# EAGLE design Fio-v30 (EAGLE 5.11)
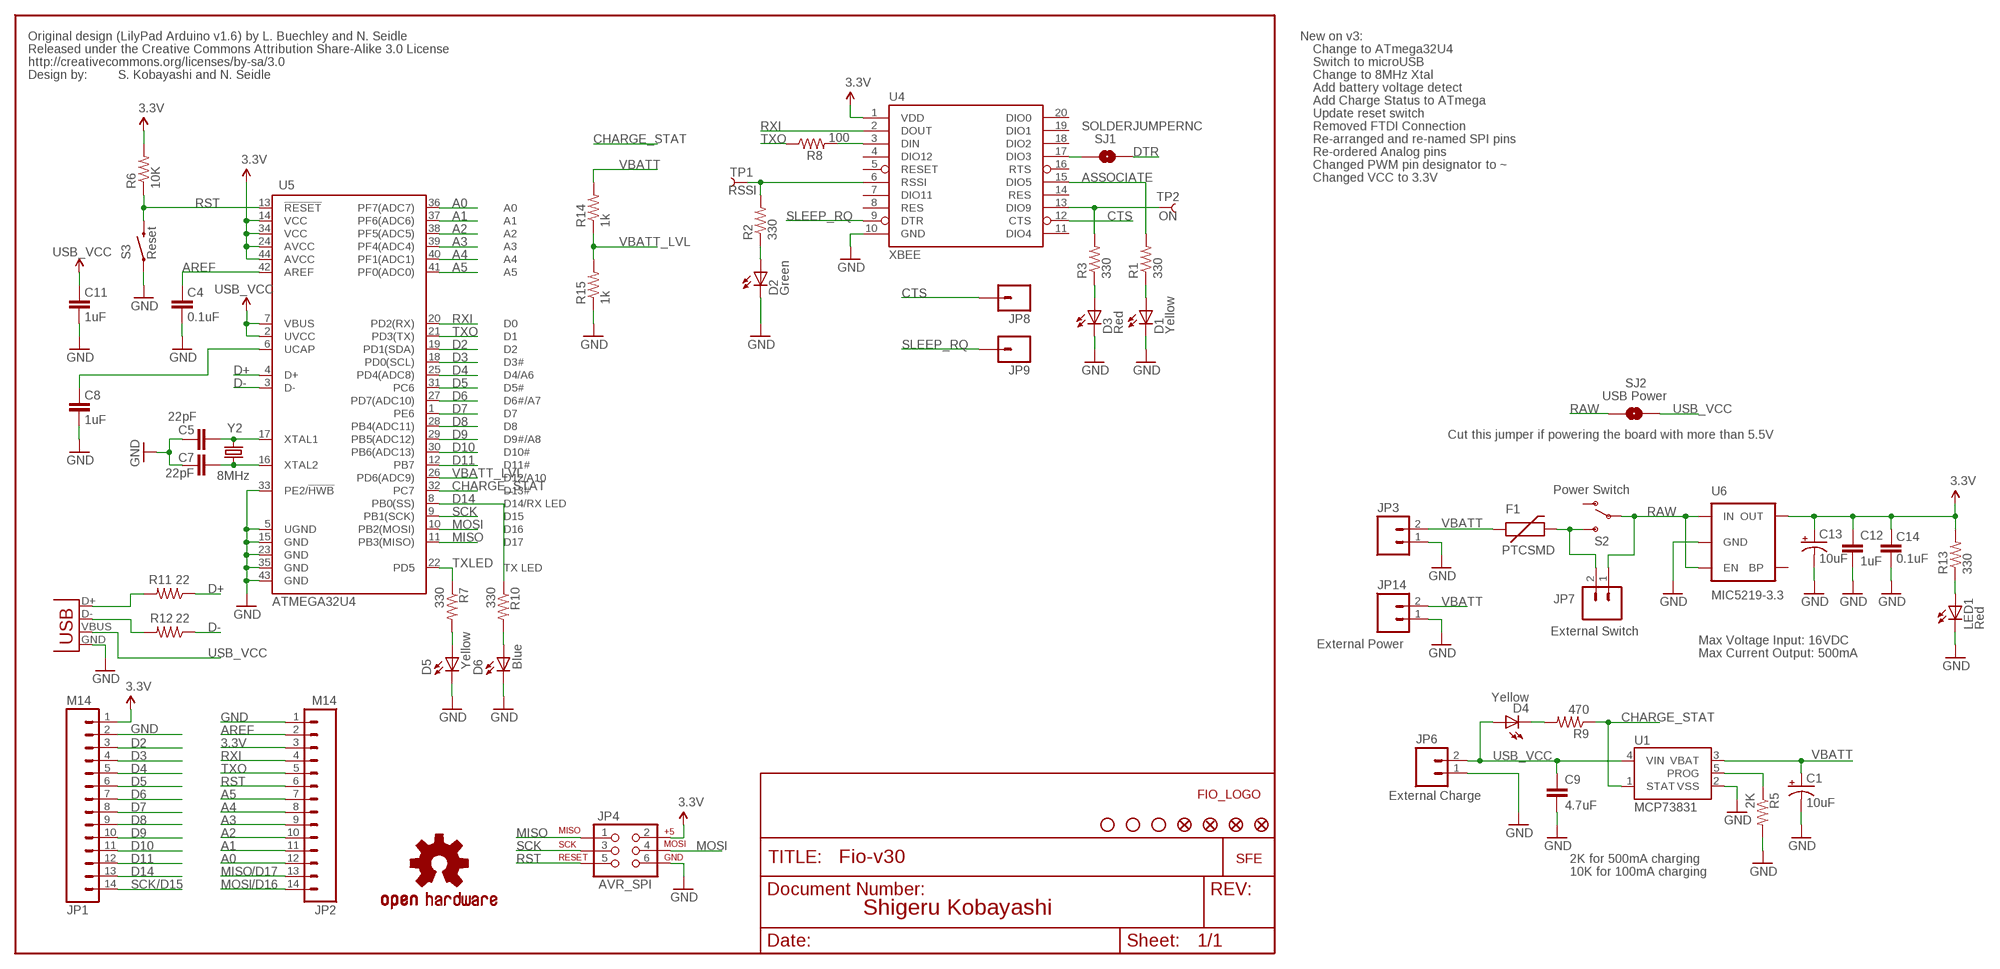
[diagram p0: schematic, sheet 1]

## Parts
C1  10uF  CAP_POL1206  [EIA3216]
C4  0.1uF  CAP0402-CAP  [0402-CAP]
C5  22pF  CAP0402-CAP  [0402-CAP]
C7  22pF  CAP0402-CAP  [0402-CAP]
C8  1uF  CAP0402-CAP  [0402-CAP]
C9  4.7uF  CAP0402-CAP  [0402-CAP]
C11  1uF  CAP0402-CAP  [0402-CAP]
C12  1uF  CAP0402-CAP  [0402-CAP]
C13  10uF  CAP_POL1206  [EIA3216]
C14  0.1uF  CAP0402-CAP  [0402-CAP]
D1  Yellow  LED0603  [LED-0603]
D2  Green  LED0603  [LED-0603]
D3  Red  LED0603  [LED-0603]
D4  Yellow  LED0603  [LED-0603]
D5  Yellow  LED0603  [LED-0603]
D6  Blue  LED0603  [LED-0603]
F1  PTCSMD  [PTC-1206]
JP1  M14  [1X14]
JP2  M14  [1X14]
JP3  M02-JST-2MM-SMT  [JST-2-SMD]
JP4  AVR_SPI  AVR_SPI_PRG_6PTH  [2X3]
JP5  STAND-OFF  [STAND-OFF]
JP6  External Charge  M02PTH  [1X02]
JP7  External Switch  M02PTH  [1X02]
JP8  M01PTH  [1X01]
JP9  M01PTH  [1X01]
JP10  FIDUCIALUFIDUCIAL  FIDUCIAL1X2  [FIDUCIAL-1X2]
JP11  FIDUCIALUFIDUCIAL  FIDUCIAL1X2  [FIDUCIAL-1X2]
JP12  FIDUCIALUFIDUCIAL  FIDUCIAL1X2  [FIDUCIAL-1X2]
JP13  FIDUCIALUFIDUCIAL  FIDUCIAL1X2  [FIDUCIAL-1X2]
JP14  External Power  M02PTH  [1X02]
JP16  STAND-OFF  [STAND-OFF]
JP17  STAND-OFF  [STAND-OFF]
LED1  Red  LED0603  [LED-0603]
R1  330  RESISTOR0402-RES  [0402-RES]
R2  330  RESISTOR0402-RES  [0402-RES]
R3  330  RESISTOR0402-RES  [0402-RES]
R5  2K  RESISTOR0402-RES  [0402-RES]
R6  10K  RESISTOR0402-RES  [0402-RES]
R7  330  RESISTOR0402-RES  [0402-RES]
R8  100  RESISTOR0402-RES  [0402-RES]
R9  470  RESISTOR0402-RES  [0402-RES]
R10  330  RESISTOR0402-RES  [0402-RES]
R11  22  RESISTOR0402-RES  [0402-RES]
R12  22  RESISTOR0402-RES  [0402-RES]
R13  330  RESISTOR0402-RES  [0402-RES]
R14  1k  RESISTOR0402-RES  [0402-RES]
R15  1k  RESISTOR0402-RES  [0402-RES]
S2  Power Switch  SWITCH-SPSTSMD  [AYZ0202]
S3  Reset  SWITCH-MOMENTARY-2SMD  [TACTILE_SWITCH_SMD]
SJ1  SOLDERJUMPERNC  [SJ_2S]
SJ2  USB Power  SOLDERJUMPERTRACE  [SJ_2S-TRACE]
TP1  RSSI  TEST-POINT3X5  [PAD.03X.05]
TP2  ON  TEST-POINT3X5  [PAD.03X.05]
U1  MCP73831  [SOT23-5]
U4  XBEE  XBEE-1B3  [XBEE-SMD]
U5  ATMEGA32U4  ATMEGA32U4QFN2  [QFN-44-NOPAD]
U6  MIC5219-3.3  V_REG_LDOSMD  [SOT23-5]
U$1  LOGO-SFENEW  [SFE-NEW-WEBLOGO]
U$2  OSHW-LOGOS  [OSHW-LOGO-S]
U$3  CREATIVE_COMMONS  [CREATIVE_COMMONS]
U$6  FIO_LOGOV2  [FUNNEL_LOGO_BOTTOM_V2]
X2  USB-MICROB  [USB-MICROB]
Y2  8MHz  CRYSTAL5X3  [CRYSTAL-SMD-5X3]

## Nets
3.3V [vcc]: C12.1 C13.A(+) C14.2 JP1.1 JP2.3 JP4.2 R6.2 R13.2 U4.1(VDD) U5.14(VCC) U5.24(AVCC) U5.34(VCC) U5.44(AVCC) U6.5(OUT)
A0: JP2.12 U5.36(PF7(ADC7))
A1: JP2.11 U5.37(PF6(ADC6))
A2: JP2.10 U5.38(PF5(ADC5))
A3: JP2.9 U5.39(PF4(ADC4))
A4: JP2.8 U5.40(PF1(ADC1))
A5: JP2.7 U5.41(PF0(ADC0))
AREF: C4.2 JP2.2 U5.42(AREF)
ASSOCIATE: R1.2 U4.15(DIO5)
CHARGE_STAT: R9.1 U1.1(STAT) U5.32(PC7)
CTS: JP8.1 U4.12(CTS)
D2: JP1.3 U5.19(PD1(SDA))
D3: JP1.4 U5.18(PD0(SCL))
D4: JP1.5 U5.25(PD4(ADC8))
D5: JP1.6 U5.31(PC6)
D6: JP1.7 U5.27(PD7(ADC10))
D7: JP1.8 U5.1(PE6)
D8: JP1.9 U5.28(PB4(ADC11))
D9: JP1.10 U5.29(PB5(ADC12))
D10: JP1.11 U5.30(PB6(ADC13))
D11: JP1.12 U5.12(PB7)
D14: JP1.13 R10.1 U5.8(PB0(SS))
D+: R11.1 U5.4(D+)
D-: R12.1 U5.3(D-)
DTR: SJ1.2
GND: C1.C(-) C4.1 C5.2 C7.2 C8.1 C9.2 C11.1 C12.2 C13.C(-) C14.1 D1.C D2.C D3.C D5.C D6.C JP1.2 JP2.1 JP3.1 JP4.6 JP6.1 JP14.1 LED1.C R5.2 R15.1 S3.1 U1.2(VSS) U4.10(GND) U5.5(UGND) U5.15(GND) U5.23(GND) U5.33(PE2/!HWB) U5.35(GND) U5.43(GND) U6.2(GND) X2.GND
MISO: JP2.13 JP4.1 U5.11(PB3(MISO))
MOSI: JP2.14 JP4.4 U5.10(PB2(MOSI))
N$1: R3.2 TP2.P$1 U4.13(DIO9)
N$2: D1.A R1.1
N$3: D2.A R2.1
N$4: R2.2 TP1.P$1 U4.6(RSSI)
N$6: D3.A R3.1
N$7: R8.2 U4.3(DIN)
N$8: D4.C R9.2
N$9: F1.2 JP7.2 S2.3(S)
N$11: R5.1 U1.5(PROG)
N$13: SJ1.1 U4.17(DIO3)
N$15: D5.A R7.2
N$16: C7.1 U5.16(XTAL2) Y2.1
N$17: C5.1 U5.17(XTAL1) Y2.3
N$19: D6.A R10.2
N$20: R12.2 X2.D-
N$21: R11.2 X2.D+
N$38: LED1.A R13.1
RAW [vcc]: JP7.1 S2.2(P) SJ2.1 U6.1(IN) U6.3(EN)
RST: JP2.6 JP4.5 R6.1 S3.3 U5.13(!RESET)
RXI: JP2.4 U4.2(DOUT) U5.20(PD2(RX))
SCK: JP1.14 JP4.3 U5.9(PB1(SCK))
SLEEP_RQ: JP9.1 U4.9(DTR)
TXLED: R7.1 U5.22(PD5)
TXO: JP2.5 R8.1 U5.21(PD3(TX))
UCAP: C8.2 U5.6(UCAP)
USB_VCC: C9.1 C11.2 D4.A JP6.2 SJ2.2 U1.4(VIN) U5.2(UVCC) U5.7(VBUS) X2.VBUS
VBATT: C1.A(+) F1.1 JP3.2 JP14.2 R14.2 U1.3(VBAT)
VBATT_LVL: R14.1 R15.2 U5.26(PD6(ADC9))
Unconnected: S2.1(O) U4.4(DIO12) U4.5(RESET) U4.7(DIO11) U4.8(RES) U4.11(DIO4) U4.14(RES) U4.16(RTS) U4.18(DIO2) U4.19(DIO1) U4.20(DIO0) U6.4(BP)

## Notes on the sheet
- Original design (LilyPad Arduino v1.6) by L. Buechley and N. Seidle | New on v3:
- Change to ATmega32U4
- Switch to microUSB
- S. Kobayashi and N. Seidle | Change to 8MHz Xtal
- Add battery voltage detect
- Add Charge Status to ATmega
- Update reset switch
- Removed FTDI Connection
- Re-arranged and re-named SPI pins
- Re-ordered Analog pins
- Changed PWM pin designator to ~
- Changed VCC to 3.3V
- Cut this jumper if powering the board with more than 5.5V
- Max Voltage Input: 16VDC
- Max Current Output: 500mA
- 2K for 500mA charging
- /D17 | 10K for 100mA charging
- /D15 | /D16
- Shigeru Kobayashi

## Library data of the parts
C1 C13 = SparkFun:CAP_POL: Capacitor Polarized These are standard SMD and PTH capacitors. Normally 10uF, 47uF, and 100uF in electrolytic and tantalum varieties. Always verify the external diameter of the through hole cap, it varies with capacity, voltage, and manufacturer. The EIA devices should be standard.
C4 C5 C7-C9 C11 C12 C14 = SparkFun:CAP: Capacitor Standard 0603 ceramic capacitor, and 0.1" leaded capacitor.
D1-D6 LED1 = SparkFun:LED: LEDs Standard schematic elements and footprints for 5mm, 3mm, 1206, and 0603 sized LEDs. 5mm - Spark Fun Electronics SKU : COM-00529 (and others)
F1 = SparkFun:PTC: Resettable Fuse PTC Resettable Fuse. Spark Fun Electronics SKU : COM-08357
JP1 JP2 = SparkFun:M14: Header 14 Standard 14-pin 0.1" header. Use with straight break away headers (SKU : PRT-00116), right angle break away headers (PRT-00553), swiss pins (PRT-00743), machine pins (PRT-00117), and female headers (PRT-00115).
JP3 JP6 JP7 JP14 = SparkFun:M02: Header 2 Standard 2-pin 0.1" header. Use with straight break away headers (SKU : PRT-00116), right angle break away headers (PRT-00553), swiss pins (PRT-00743), machine pins (PRT-00117), and female headers (PRT-00115). Molex polarized connector foot print use with SKU : PRT-08233 with associated crimp pins and housings.
JP4 = SparkFun:AVR_SPI_PRG_6: AVR ISP 6 Pin This is the reduced ISP connector for AVR programming. Common on Arduino. This footprint will take up less PCB space and can be used with a 10-pin to 6-pin adapter such as SKU: BOB-08508
JP5 JP16 JP17 = SparkFun:STAND-OFF: Stand Off This is the mechanical footprint for a #4 phillips button head screw. Use the keepout ring to avoid running the screw head into surrounding components. SKU : PRT-00447
JP8 JP9 = SparkFun:M01: Header 1 Standard 1-pin 0.1" header. Use with straight break away headers (SKU : PRT-00116), right angle break away headers (PRT-00553), swiss pins (PRT-00743), machine pins (PRT-00117), and female headers (PRT-00115).
JP10-JP13 = SparkFun:FIDUCIAL: Fiducial Alignment Points Various fiducial points for machine vision alignment.
R1-R3 R5-R15 = SparkFun:RESISTOR: Resistor Basic schematic elements and footprints for 0603, 1206, and PTH resistors.
S2 = SparkFun:SWITCH-SPST: SPST Switch Simple slide switch. Spark Fun Electronics SKU : COM-00102
S3 = SparkFun:SWITCH-MOMENTARY-2
SJ1 SJ2 = SparkFun:SOLDERJUMPER: Solder Jumper Standard SMD solder jumper. Used to automate production. Two varients : Normally Open and Normally Closed are the same, but have different paste layers. NC will have a large amount of paste and should jumper during reflow.
TP1 TP2 = SparkFun:TEST-POINT
U1 = SparkFun:MCP73831: Microchip's MCP73831 Miniature single cell, fully integrated Li-Ion, Li-polymer charge management controller http://ww1.microchip.com/downloads/en/DeviceDoc/21984a.pdf
U4 = SparkFun:XBEE-1
U5 = QFN44:ATMEGA32U4
U6 = SparkFun:V_REG_LDO: Voltage Regulator LDO Standard 150mA LDO voltage regulator in SOT-23 layout. Micrel part MIC5205. BP (by-pass) pin is used to lower output noise with 470pF cap.
U$1 = SparkFun:LOGO-SFE: Spark Fun Electronics PCB Logo This is the standard Spark Fun Electronics PCB logo.
U$2 = SparkFun:OSHW-LOGO: Open Source Hardware Logo This logo indicates the piece of hardware it is found on incorporates a OSHW license and/or adheres to the definition of open source hardware found here: http://freedomdefined.org/OSHW
U$3 = SparkFun:CREATIVE_COMMONS
U$6 = SparkFun:FIO_LOGO
X2 = SparkFun:USB: USB Connectors USB-B-PTH is fully proven SKU : PRT-00139 USB-miniB is fully proven SKU : PRT-00587 USB-A-PCB is untested. USB-A-H is throughly reviewed, but untested. Spark Fun Electronics SKU : PRT-00437 USB-B-SMT is throughly reviewed, but untested. Needs silkscreen touching up. USB-A-S has not been used/tested USB-MB-H has not been used/tested
Y2 = SparkFun:CRYSTAL: Crystals Various standard crystals. Proven footprints. Spark Fun Electronics SKU : COM-00534

## Net classes
0 Default: width 0.203 mm
2 LEDPower: width 0.203 mm
3 ButtonSignal: width 0.203 mm

## Board
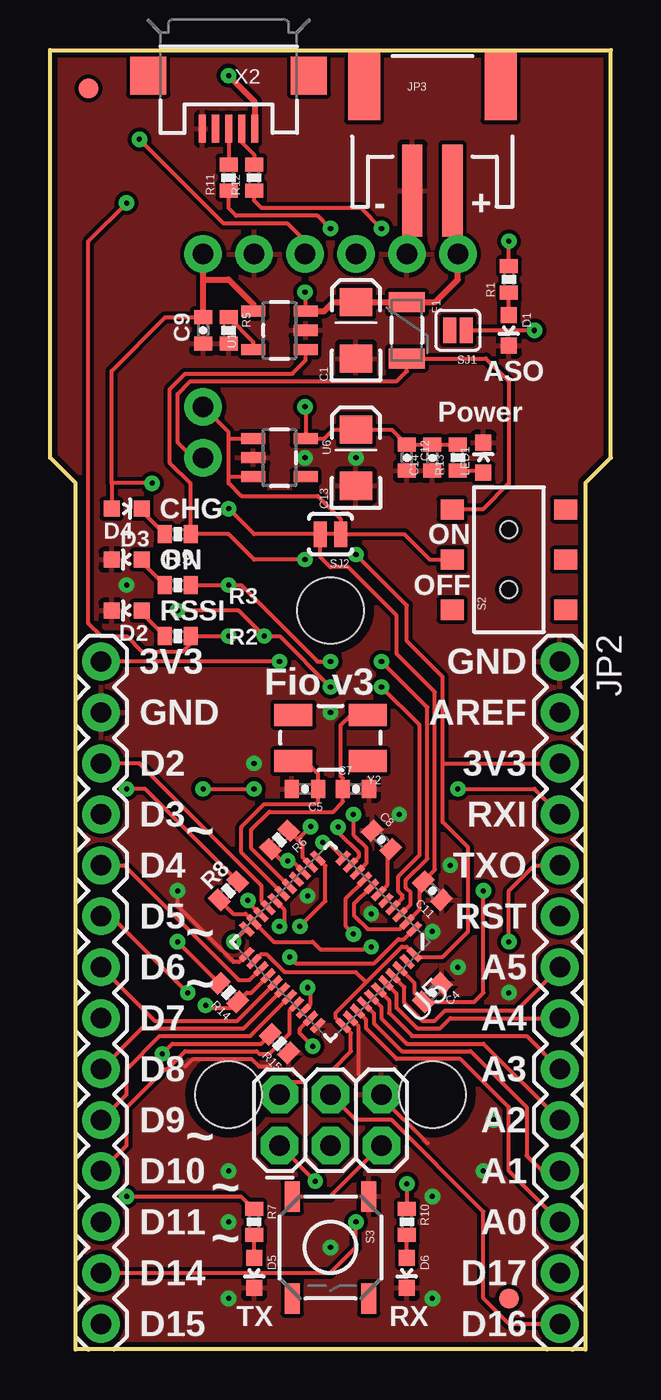
[diagram p1: board, top side]
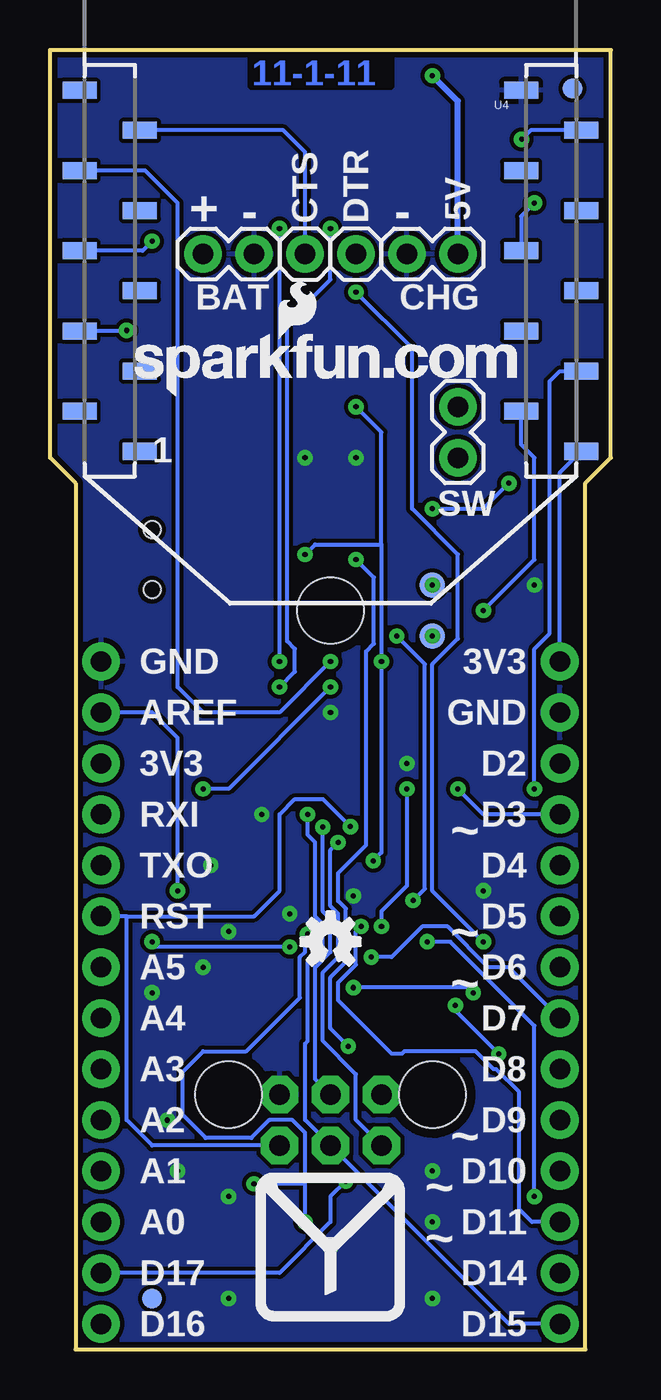
[diagram p2: board, bottom side, seen from below]

Size 27.94 x 64.77 mm. Coordinates in mm from the lower left corner, seen from the top.
Outline: 26.67,43.18 26.67,0 1.27,0 1.27,43.18 0,44.45 0,64.77 27.94,64.77 27.94,44.45 26.67,43.18
Copper layers (1*16): Top 0.035mm / dielectric 1.5mm / Bottom 0.035mm
Design rules "SparkFun *": minimum track width 8mil, minimum drill 10mil, track to track 7mil, track to pad 7mil, pad to pad 7mil, via to via 7mil, smd to smd 7mil, copper to edge 10mil, drill to drill 8mil, minimum pad ring 12mil, minimum via ring 10mil, stop-mask expansion 4mil, vias tented up to drill 20mil, thermal gap 10mil

### Footprints (pad centres in the part's own frame; a part is rotated, then mirrored left to right if it is on the bottom)
EIA3216 = smd 1.4 x 1.6: A 1.4,0; C -1.4,0
0402-CAP = smd 0.7 x 0.9: 1 -0.65,0; 2 0.65,0
LED-0603 = smd 0.8 x 0.8: A 0,-0.75; C 0,0.75
PTC-1206 = smd 1 x 1.8: 1 -1.4,0; 2 1.4,0
1X14 = drill 1.016 pad 1.88 round: 1 0,0; 2 2.54,0; 3 5.08,0; 4 7.62,0; 5 10.16,0; 6 12.7,0; 7 15.24,0; 8 17.78,0; 9 20.32,0; 10 22.86,0; 11 25.4,0; 12 27.94,0; 13 30.48,0; 14 33.02,0
JST-2-SMD = smd 1 x 4.6: 1 -1,-3.7; 2 1,-3.7 | smd 1.6 x 3.4: NC1 -3.4,1.5; NC2 3.4,1.5
2X3 = drill 1.016 pad 1.88 octagon: 1 0,0; 2 0,2.54; 3 2.54,0; 4 2.54,2.54; 5 5.08,0; 6 5.08,2.54
STAND-OFF = hole 3.302: 0,0
1X02 = drill 1.016 pad 1.88 round: 1 0,0; 2 2.54,0
1X01 = drill 1.016 pad 1.88 round: 1 0,0
FIDUCIAL-1X2 = smd 1 x 1: 1 0,0
0402-RES = smd 0.7 x 0.9: 1 -0.65,0; 2 0.65,0
AYZ0202 = smd 1 x 1.15: 1 -2.5,2.825; 2 0,2.825; 3 2.5,2.825; 4 -2.5,-2.825; 5 0,-2.825; 6 2.5,-2.825 | hole 0.85: 1.5,0; -1.5,0
TACTILE_SWITCH_SMD = smd 1.524 x 0.762: 1 -2.54,1.905; 2 2.54,1.905; 3 -2.54,-1.905; 4 2.54,-1.905
SJ_2S = smd 0.635 x 1.27: 1 -0.412,0; 2 0.412,0
SJ_2S-TRACE = smd 0.635 x 1.27: 1 -0.508,0; 2 0.508,0
PAD.03X.05 = smd 1.27 x 1.27: P$1 0,0
SOT23-5 = smd 0.55 x 1.2: 1 -0.95,-1.3; 2 0,-1.3; 3 0.95,-1.3; 4 0.95,1.3; 5 -0.95,1.3
XBEE-SMD = smd 1.7 x 0.85: 1 -12.5,20; 2 -9.5,18; 3 -12.5,16; 4 -9.5,14; 5 -12.5,12; 6 -9.5,10; 7 -12.5,8; 8 -9.5,6; 9 -12.5,4; 10 -9.5,2; 11 12.5,2; 12 9.5,4; 13 12.5,6; 14 9.5,8; 15 12.5,10; 16 9.5,12; 17 12.5,14; 18 9.5,16; 19 12.5,18; 20 9.5,20
QFN-44-NOPAD = smd 0.8 x 0.3: 1 -3.4,2.5; 2 -3.4,2; 3 -3.4,1.5; 4 -3.4,1; 5 -3.4,0.5; 6 -3.4,0; 7 -3.4,-0.5; 8 -3.4,-1; 9 -3.4,-1.5; 10 -3.4,-2; 11 -3.4,-2.5; 23 3.4,-2.5; 24 3.4,-2; 25 3.4,-1.5; 26 3.4,-1; 27 3.4,-0.5; 28 3.4,0; 29 3.4,0.5; 30 3.4,1; 31 3.4,1.5; 32 3.4,2; 33 3.4,2.5 | smd 0.3 x 0.8: 12 -2.5,-3.4; 13 -2,-3.4; 14 -1.5,-3.4; 15 -1,-3.4; 16 -0.5,-3.4; 17 0,-3.4; 18 0.5,-3.4; 19 1,-3.4; 20 1.5,-3.4; 21 2,-3.4; 22 2.5,-3.4; 34 2.5,3.4; 35 2,3.4; 36 1.5,3.4; 37 1,3.4; 38 0.5,3.4; 39 0,3.4; 40 -0.5,3.4; 41 -1,3.4; 42 -1.5,3.4; 43 -2,3.4; 44 -2.5,3.4
USB-MICROB = smd 0.35 x 1.4: D+ 0,2.65; D- -0.65,2.65; GND 1.3,2.65; ID 0.65,2.65; VBUS -1.3,2.65 | smd 1.8 x 1.9: MT1 -4,0; MT2 4,0
CRYSTAL-SMD-5X3 = smd 1.9 x 1.1: 1 -1.85,-1.15; 2 1.85,-1.15; 3 1.85,1.15; 4 -1.85,1.15

### Placement (x,y rotation side)
C1  15.24,50.8 90 top
C4  19.05,17.78 225 top
C5  12.7,27.94 180 top
C7  15.24,27.94 0 top
C8  16.51,25.4 315 top
C9  7.62,50.8 270 top
C11  19.05,22.86 135 top
C12  17.78,44.45 270 top
C13  15.24,44.45 90 top
C14  19.05,44.45 90 top
D1  22.86,50.8 180 top
D2  3.81,36.83 90 top
D3  3.81,39.37 90 top
D4  3.81,41.91 270 top
D5  10.16,3.81 180 top
D6  17.78,3.81 180 top
F1  17.78,50.8 270 top
JP1  2.54,34.29 270 top
JP2  25.4,34.29 270 top
JP3  19.05,61.47 0 top
JP4  11.43,10.16 0 top
JP5  8.89,12.7 0 top
JP6  10.16,54.61 0 bottom
JP7  7.62,46.99 270 bottom
JP8  15.24,54.61 0 bottom
JP9  12.7,54.61 0 bottom
JP10  22.86,2.54 0 top
JP11  1.91,62.87 0 top
JP12  1.91,62.87 0 bottom
JP13  22.86,2.54 0 bottom
JP14  17.78,54.61 180 bottom
JP16  13.97,36.83 0 top
JP17  19.05,12.7 0 top
LED1  21.59,44.45 0 top
R1  22.86,53.34 90 top
R2  6.35,35.56 0 top
R3  6.35,38.1 0 top
R5  8.89,50.8 270 top
R6  11.43,25.4 225 top
R7  10.16,6.35 270 top
R8  8.89,22.86 45 top
R9  6.35,40.64 180 top
R10  17.78,6.35 270 top
R11  8.89,58.42 90 top
R12  10.16,58.42 90 top
R13  20.32,44.45 90 top
R14  8.89,17.78 135 top
R15  11.43,15.24 135 top
S2  22.86,39.37 90 top
S3  13.97,5.08 270 top
SJ1  20.32,50.8 180 top
SJ2  13.97,40.64 180 top
TP1  8.89,35.56 0 bottom
TP2  8.89,38.1 0 bottom
U1  11.43,50.8 90 top
U4  13.97,64.77 180 bottom
U5  13.97,20.32 225 top
U6  11.43,44.45 270 top
U$1  23.75,47.5 0 bottom
U$2  13.97,20.32 0 bottom
U$3  -11.43,-8.89 0 top  (outside the outline)
U$6  13.97,5.08 0 top
X2  8.89,63.5 180 top
Y2  13.97,30.48 180 top

### Tracks (layer width: path | path; a pad name or v marks a point on that pad's centre or on a via)
3.3V  (via drill 0.25)
  Top 0.203: R13.2 C14.2 C12.1 17.03,45.85 C13.A 14.1,45.85 13.65,45.4 U6.5 12.73,46.96 v12.7,46.99 | v11.43,34.29 JP1.1 | JP4.2 12.06,13.34 12.7,13.34 13.33,13.97 14.1,13.97 14.99,14.86 14.99,15.77 U5.34 14.22,16.53 14.22,16.76 15.75,18.29 | 19.56,29.21 JP2.3 | 19.56,29.21 19.56,26.29 20.83,25.02 20.83,20.83 19.56,19.56 18.27,19.56 U5.44 17.76,20.07 17.53,20.07 16.65,19.19 | U5.24 10.51,19.68 10.79,19.68 11.68,18.8 15.24,18.8 15.75,18.29 | 16.65,19.19 | 15.75,18.29 16.65,19.19 | 19.56,29.21 19.56,33.53 17.78,35.31 17.78,37.08 v15.24,39.62 | U5.14 12.05,24.36 v11.84,24.36 11.55,24.36 R6.2
  Bottom 0.203: JP1.1 2.54,43.7 U4.1 | 11.43,40.13 11.43,45.72 v12.7,46.99 | 11.43,40.13 v11.43,34.29 11.43,24.77 v11.84,24.36 | 11.43,40.13 14.73,40.13 v15.24,39.62
A0
  Top 0.203: U5.36 15.75,16.42 15.75,16 17.27,14.48 20.45,14.48 22.86,12.06 22.86,8.89 JP2.12
A1
  Top 0.203: U5.37 16.13,16.75 16.13,16.26 17.53,14.86 20.95,14.86 23.75,12.06 23.75,9.65 24.51,8.89 JP2.11
A2
  Top 0.203: U5.38 16.51,17.07 16.51,16.51 17.78,15.24 21.59,15.24 JP2.10
A3
  Top 0.203: U5.39 16.89,17.4 16.89,16.76 18.03,15.62 23.75,15.62 JP2.9
A4
  Top 0.203: U5.40 17.27,17.73 17.27,17.02 18.29,16 19.43,16 19.94,16.51 JP2.8
A5
  Top 0.203: U5.41 17.65,18.05 17.65,17.27 18.54,16.38 19.18,16.38 19.68,16.89 23.24,16.89 JP2.7
AREF  (via drill 0.25)
  Top 0.203: U5.42 18.16,18.25 18.16,17.75 C4.2 21.13,17.32 21.59,17.78 v21.59,22.86
  Bottom 0.203: JP2.2 22.86,31.75 21.59,30.48 v21.59,22.86
ASSOCIATE  (via drill 0.25)
  Top 0.203: R1.2 v22.86,55.24
  Bottom 0.203: U4.15 23.34,54.77 v22.86,55.24
CHARGE_STAT  (via drill 0.25)
  Top 0.203: v12.7,39.37 10.16,39.37 8.89,40.64 R9.1 7,43.16 5.97,44.2 5.97,47.88 6.73,48.64 12.06,48.64 12.73,49.31 U1.1 | U5.32 12.45,15.97 12.45,15.75 v13.08,15.11
  Bottom 0.203: v13.08,15.11 13.97,16 13.97,18.54 13.21,19.3 13.21,21.97 13.59,22.35 13.59,23.75 12.19,25.15 12.19,34.8 11.81,35.18 11.81,38.48 v12.7,39.37
CTS
  Bottom 0.203: U4.12 16.32,60.77 15.24,59.69 JP8.1
D2
  Top 0.203: U5.19 10.54,22.34 10.54,23.11 4.45,29.21 JP1.3
D3  (via drill 0.25)
  Top 0.203: v7.62,27.94 v10.16,27.94 | U5.18 11.68,21.9 11.68,21.34 v11.43,21.08
  Bottom 0.203: v7.62,27.94 6.35,26.67 JP1.4 | v10.16,27.94 10.16,23.11 11.43,21.84 v11.43,21.08
D4
  Top 0.203: U5.25 9.94,18.41 9.4,18.41 3.68,24.13 JP1.5
D5  (via drill 0.25)
  Top 0.203: U5.31 12.95,17.18 12.95,17.91 v12.83,18.03 | v6.86,17.78 3.05,21.59 JP1.6
  Bottom 0.203: v12.83,18.03 7.11,18.03 v6.86,17.78
D6
  Top 0.203: U5.27 9.33,16.38 5.21,16.38 JP1.7
D7  (via drill 0.25)
  Top 0.203: U5.1 17.63,20.45 17.35,20.45 16.15,19.25 12.24,19.25 v11.94,19.56
  Bottom 0.203: JP1.8 5.08,19.05 6.1,19.05 8.13,21.08 9.4,21.08 10.92,19.56 v11.94,19.56
D8
  Top 0.203: JP1.9 4.57,16 9.65,16 U5.28
D9
  Top 0.203: U5.29 9.98,15.62 5.46,15.62 3.81,13.97 3.81,12.7 JP1.10
D10
  Top 0.203: U5.30 11.94,16.87 11.94,15.75 10.92,14.73 10.41,14.73 10.29,14.86 6.73,14.86 5.84,13.97 5.71,13.97 3.81,12.06 3.81,10.16 JP1.11
D11  (via drill 0.25)
  Top 0.203: U5.12 13.72,24.11 13.72,22.35 v12.45,21.08
  Bottom 0.203: JP1.12 3.94,6.35 4.57,6.99 4.57,12.83 5.71,13.97 5.84,13.97 6.73,14.86 10.29,14.86 10.41,14.73 10.92,14.73 13.59,17.4 13.59,18.29 12.7,19.18 12.7,20.83 v12.45,21.08
D14  (via drill 0.25)
  Top 0.203: JP1.13 13.97,3.81 15.24,5.08 v15.24,6.35 | v17.78,8.26 R10.1 | U5.8 15.67,23.41 14.73,22.48 14.73,21.08 v15.11,20.7
  Bottom 0.203: 15.24,8.26 15.24,10.79 15.88,11.43 17.02,11.43 17.91,10.54 20.19,10.54 21.34,11.68 21.34,13.84 20.32,14.86 18.16,14.86 15.49,17.53 15.49,19.56 15.24,19.81 15.24,20.57 v15.11,20.7 | 15.24,8.26 v17.78,8.26 | v15.24,6.35 15.24,8.26
D+  (via drill 0.25)
  Top 0.203: v16.51,33.02 18.41,31.11 18.41,24.64 17.35,23.57 17.35,22.84 17.55,22.63 17.55,22.49 U5.4 | R11.1 8.89,56.9 9.27,56.52 13.33,56.52 v13.97,55.88
  Bottom 0.203: v13.97,55.88 13.97,53.34 16.13,51.18 16.13,35.31 15.75,34.92 15.75,33.78 v16.51,33.02
D-  (via drill 0.25)
  Top 0.203: R12.1 10.16,57.28 10.54,56.9 15.49,56.9 v16.51,55.88 | v16.51,34.29 18.8,32 18.8,24.46 17.73,23.39 17.73,23.01 17.96,22.78 17.96,22.19 U5.3
  Bottom 0.203: v16.51,34.29 v16.51,55.88
GND  (via drill 0.25)
  Top 0.203: U5.23 9.42,19.3 9.14,19.3 6.35,22.1 v6.35,22.86 | U5.35 15.37,16.09 15.37,13.72 | JP4.6 16.51,12.57 18.8,10.29 | 10.92,14.1 10.41,14.1 10.03,14.48 7.11,14.48 6.73,14.1
  other vias: 17.4,26.67 13.97,5.08 19.05,2.54 8.89,2.54 22.1,11.43 22.86,17.78 19.05,20.83 15.24,44.45 12.7,44.45 3.81,38.1 13.97,31.75 19.94,24.13 20.32,19.05 12.83,22.61 10.16,29.21 19.05,7.62 16,21.72 8.89,8.89 8.89,6.35 21.59,8.89
  pour Top (isolate 0.203): 0,64.77 27.94,64.77 27.94,0 0,0
  pour Bottom (isolate 0.203): 0,64.77 27.94,64.77 27.94,0 0,0
MISO  (via drill 0.25)
  Top 0.203: U5.11 13.82,25.27 v13.59,25.27 | v13.21,8.38 JP4.1
  Bottom 0.203: v13.59,25.27 13.97,24.89 13.97,22.1 13.59,21.72 13.59,19.56 14.35,18.8 14.35,15.37 12.7,13.72 12.7,11.43 JP4.1 | v13.21,8.38 13.97,7.62 13.97,6.35 16.51,3.81 JP2.13
MOSI  (via drill 0.25)
  Top 0.203: U5.10 15.37,24.55 15.37,24.77 14.35,25.78 v14.35,26.04 | JP4.4 15.24,11.43 17.02,11.43 21.59,6.86 21.59,2.54 22.86,1.27 JP2.14
  Bottom 0.203: v14.35,26.04 14.35,21.84 13.97,21.46 13.97,19.81 14.73,19.05 14.73,13.46 JP4.4
N$1  (via drill 0.25)
  Top 0.203: R3.2 TP2.P$1 9.53,38.1 13.33,34.29 v13.97,34.29
  Bottom 0.203: U4.13 23.21,58.77 21.59,57.15 21.59,33.02 20.32,31.75 16.51,31.75 v13.97,34.29
  other vias: 8.89,38.1
N$2
  Top 0.203: D1.A R1.1
N$3
  Top 0.203: D2.A 4.56,36.7 R2.1
N$4  (via drill 0.25)
  Top 0.203: R2.2 TP1.P$1 | R2.2 7,35.67 | v3.81,57.15 1.91,55.24 1.91,36.2 2.54,35.56 3.81,35.56 4.57,34.8 6.6,34.8 7,35.19 R2.2
  Bottom 0.203: U4.6 4.47,56.49 v3.81,57.15
  other vias: 8.89,35.56
N$6
  Top 0.203: D3.A 4.56,39.24 R3.1
N$7  (via drill 0.25)
  Top 0.203: R8.2 4.73,27.94 v3.81,27.94
  Bottom 0.203: v3.81,27.94 3.81,34.92 3.05,35.69 3.05,48.26 2.54,48.77 U4.3
N$8
  Top 0.203: D4.C 4.56,41.78 R9.2
N$9
  Top 0.203: S2.3 21.55,41.87 22.86,43.18 22.86,48.26 21.72,49.4 F1.2 17.78,48.77 17.27,48.26 6.98,48.26 6.35,47.62 6.35,45.21 7.11,44.45 JP7.2
N$11
  Top 0.203: U1.5 10.13,50.21 R5.1
N$13  (via drill 0.25)
  Top 0.203: SJ1.1 v24.13,50.8
  Bottom 0.203: v24.13,50.8 24.16,50.77 U4.17
N$15
  Top 0.203: D5.A R7.2
N$16
  Top 0.203: Y2.1 14.99,31.63 14.48,31.11 14.48,28.57 14.59,28.46 C7.1 14.59,27.29 14.1,26.8 10.92,26.8 10.03,25.91 10.03,24.96 U5.16
N$17
  Top 0.203: Y2.3 12.71,29.33 13.35,28.69 C5.1 13.35,27.32 13.21,27.18 10.67,27.18 9.53,26.04 9.53,24.77 U5.17
N$19
  Top 0.203: D6.A R10.2
N$20
  Top 0.203: X2.D- 9.54,60.18 10.16,59.56 R12.2
N$21
  Top 0.203: X2.D+ R11.2
N$38
  Top 0.203: R13.1 21.49,43.8 LED1.A
RAW
  Top 0.203: S2.2 18.92,39.37 17.65,40.64 SJ2.1 14.48,41.4 13.33,42.55 9.53,42.55 8.89,43.18 8.89,43.56 | 8.89,43.56 8.89,45.47 | 8.89,45.47 8.89,45.72 JP7.1 | U6.1 8.96,45.4 8.89,45.47 | U6.3 8.95,43.5 8.89,43.56
RST  (via drill 0.25)
  Top 0.203: U5.13 12.57,24.55 12.57,25.18 12.33,25.41 | 12.33,25.41 R6.1 | v12.98,26.06 12.33,25.41 | JP4.5 13.97,7.62 S3.3
  Bottom 0.203: 24.13,21.59 JP2.6 | 24.13,21.59 17.78,21.59 16.51,22.86 16.51,26.67 15.75,27.43 14.35,27.43 v12.98,26.06 | 24.13,21.59 24.13,11.43 22.86,10.16 JP4.5
RXI  (via drill 0.25)
  Top 0.203: JP2.4 24.13,27.94 v20.32,27.94 | U5.20 9.86,22.31 v9.86,22.38 | v6.35,36.83 9.4,36.83 v10.67,35.56 11.43,35.56 v13.97,33.02
  Bottom 0.203: U4.2 4.47,45.11 3.81,44.45 3.81,39.37 v6.35,36.83 | v9.86,22.38 9.27,22.96 9.27,34.16 v10.67,35.56 | v20.32,27.94 19.05,27.94 v13.97,33.02
SCK  (via drill 0.25)
  Top 0.203: U5.9 15.75,24.22 15.75,25.02 15.11,25.65 v15.11,26.67
  Bottom 0.203: JP1.14 5.08,1.27 JP4.3 15.24,11.43 15.24,15.24 15.11,15.37 15.11,19.3 14.35,20.07 14.35,21.21 14.73,21.59 14.73,25.27 15.11,25.65 v15.11,26.67
SLEEP_RQ  (via drill 0.25)
  Top 0.203: JP9.1 12.7,55.24 11.81,56.13 8.64,56.13 v4.45,60.33
  Bottom 0.203: U4.9 4,60.77 v4.45,60.33
TXLED  (via drill 0.25)
  Top 0.203: R7.1 10.14,6.99 9.51,7.62 v3.81,7.62 | U5.22 9.78,20.96 v9.14,20.32
  Bottom 0.203: v9.14,20.32 8,20.32 3.81,16.13 v3.81,7.62
TXO  (via drill 0.25)
  Top 0.203: R8.1 9.11,21.72 9.74,21.72 U5.21 11.14,20.32 13.08,20.32 13.46,19.94 15.62,19.94 15.75,20.07 v16,20.07 | v22.86,20.32 22.86,22.86 24.13,24.13 JP2.5
  Bottom 0.203: v16,20.07 22.61,20.07 v22.86,20.32
UCAP
  Top 0.203: 16.76,24.73 C8.2 16.82,24.79 16.82,23.16 U5.6
USB_VCC  (via drill 0.25)
  Top 0.203: C9.1 5.73,51.45 3.06,48.78 3.06,43.18 | v8.89,41.91 10.16,40.64 SJ2.2 13.46,39.5 13.97,38.99 14.86,38.99 17.27,36.58 17.27,34.67 19.18,32.77 19.18,23.91 C11.2 18.41,23.14 18.41,21.94 U5.2 17.43,20.95 15.82,20.95 15.14,21.64 15.14,22.2 U5.7 | 3.06,43.18 D4.A | v5.08,43.18 3.06,43.18
  Top 0.305: 10.16,51.78 U1.4 10.13,52.1 8.89,53.34 7.62,53.34 | X2.VBUS 10.19,62.2 v8.89,63.5 | C9.1 7.62,53.34 | 7.62,53.34 JP6.2
  Bottom 0.203: v8.89,41.91 6.35,41.91 v5.08,43.18
  Bottom 0.305: v8.89,63.5 7.62,62.23 JP6.2
VBATT  (via drill 0.25)
  Top 0.203: R14.2 | R14.2 v6.35,20.32 | v12.7,52.7 12.7,51.78 U1.3
  Top 0.305: U1.3 13.65,51.75 14.1,52.2 C1.A F1.1 19.18,52.2 20.32,53.34 JP14.2 20.05,54.88 JP3.2
  Bottom 0.203: v12.7,52.7 9.91,49.91 9.91,41.91 7.62,39.62 7.62,35.43 8.89,34.16 8.89,22.86 v6.35,20.32
VBATT_LVL  (via drill 0.25)
  Top 0.203: U5.26 10.02,17.78 9.81,17.78 R14.1 9.05,17.02 7.87,17.02 v7.75,17.14 | R15.2 10.51,15.24 6.1,15.24 v5.59,14.73
  Bottom 0.203: v7.75,17.14 7.75,16.89 v5.59,14.73

### Text on the board
Bottom: 11-1-11
tPlace: - | + | ASO | Power | CHG | ON | ON | OFF | RSSI | GND | 3V3 | Fio v3 | AREF | GND | 3V3 | D2 | RXI | D3 | ~ | TXO | D4 | RST | D5 | ~ | A5 | D6 | ~ | A4 | D7 | A3 | D8 | A2 | D9 | ~ | A1 | D10 | ~ | A0 | D11 | ~ | D17 | D14 | D16 | D15 | TX | RX | S. Kobayashi and N. Seidle
bPlace: 5V | - | DTR | CTS | - | + | CHG | BAT | 1 | SW | 3V3 | GND | GND | AREF | D2 | 3V3 | D3 | RXI | D4 | ~ | TXO | D5 | RST | D6 | ~ | A5 | D7 | ~ | A4 | D8 | A3 | D9 | A2 | D10 | ~ | A1 | D11 | ~ | A0 | ~ | D14 | D17 | D15 | D16